# Altium schematic sheet USB.SchDoc
size A4; SheetNumber: 5; SheetTotal: 6
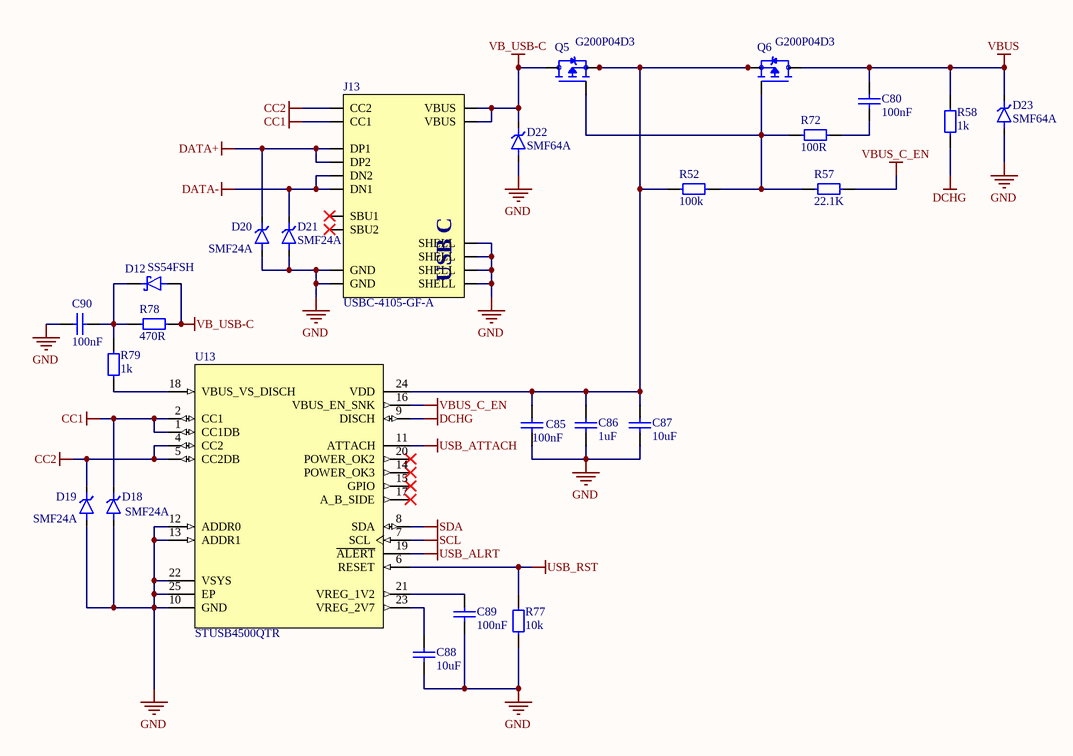
[diagram p0: USB.SchDoc]

## Parts
C80  100nF  [0603 Capacitor]
C85  100nF  [0603 Capacitor]
C86  1uF  [0603 Capacitor]
C87  10uF  [0603 Capacitor]
C88  10uF  [0603 Capacitor]
C89  100nF  [0603 Capacitor]
C90  100nF  [0603 Capacitor]
D12  SS54FSH  [SODFL4725X110N]
D18  SMF24A  [SOD3718X102N]
D19  SMF24A  [SOD3718X102N]
D20  SMF24A  [SOD3718X102N]
D21  SMF24A  [SOD3718X102N]
D22  SMF64A  [SOD3718X102N]
D23  SMF64A  [SOD3718X102N]
J13  USBC-4105-GF-A  [GCT_USB4105-GF-A]
Q5  G200P04D3  [TRANS_AONR21321]
Q6  G200P04D3  [TRANS_AONR21321]
R52  100k  [0603 Resistor]
R57  22.1K  [0603 Resistor]
R58  1k  [0603 Resistor]
R72  100R  [0603 Resistor]
R77  10k  [0603 Resistor]
R78  470R  [0603 Resistor]
R79  1k  [0603 Resistor]
U13  STUSB4500QTR  [QFN50P400X400X90-25N]

## Nets
CC1: D18.C(K1) J13.A5(CC1) U13.1(CC1DB) U13.2(CC1)
CC2: D19.C(K1) J13.B5(CC2) U13.4(CC2) U13.5(CC2DB)
DATA+: D20.C(K1) J13.A6(DP1) J13.B6(DP2)
DATA-: D21.C(K1) J13.A7(DN1) J13.B7(DN2)
DCHG: R58.1(CCW) U13.9(DISCH)
GND: C85.1 C86.1 C87.1 C88.1 C89.1 C90.1 D18.A D19.A D20.A D21.A D22.A D23.A J13.A1_B12(GND) J13.B1_A12(GND) J13.SH1(SHELL) J13.SH2(SHELL) J13.SH3(SHELL) J13.SH4(SHELL) R77.1(CCW) U13.10(GND) U13.12(ADDR0) U13.13(ADDR1) U13.22(VSYS) U13.25(EP)
SCL: U13.7(SCL)
SDA: U13.8(SDA)
USB_ALRT: U13.19(~{ALERT})
USB_ATTACH: U13.11(ATTACH)
USB_RST: R77.2(CW) U13.6(RESET)
VB_USB-C: D12.A D22.C(K1) J13.A4_B9(VBUS) J13.B4_A9(VBUS) Q5.5(D) R78.2(CW)
VBUS: C80.2 D23.C(K1) Q6.5(D) R58.2(CW)
VBUS_C_EN: R57.2(CW) U13.16(VBUS_EN_SNK)
NetC80_1: C80.1 R72.2(CW)
NetC85_2: C85.2 C86.2 C87.2 Q5.1(S) Q5.2(S) Q5.3(S) Q6.1(S) Q6.2(S) Q6.3(S) R52.1(CCW) U13.24(VDD)
NetC88_2: C88.2 U13.23(VREG_2V7)
NetC89_2: C89.2 U13.21(VREG_1V2)
NetC90_2: C90.2 D12.C(K) R78.1(CCW) R79.1(CCW)
NetQ5_4: Q5.4(G) Q6.4(G) R52.2(CW) R57.1(CCW) R72.1(CCW)
NetR79_2: R79.2(CW) U13.18(VBUS_VS_DISCH)

Not connected (* = marked no-connect by the designer): J13 A8(SBU1)* B8(SBU2)*; U13 14(POWER_OK3)* 15(GPIO)* 17(A_B_SIDE)* 20(POWER_OK2)*

## Notes on the sheet
- (in symbol USBC-4105-GF-A) USB C

## Library data of the parts
C80 C85 C89 C90 = Capacitor 100nF 0603: 100nF 50V 0603; MP: KGF15AR71H104KM
C86 = Capacitor 1uF 0603: 1uF 50V 0603
C87 C88 = Capacitor 10uF 0603: 10uF 10V 0603
D12 = SS54FSH: 5A, 40V, Schottky Rectifier; MF: Taiwan Semiconductor; Value: *; SnapEDA_Link: https://www.snapeda.com/parts/SS54FSH/Taiwan+Semiconductor/view-part/?ref=snap; MP: SS54FSH; Check_prices: https://www.snapeda.com/parts/SS54FSH/Taiwan+Semiconductor/view-part/?ref=eda; Availability: In Stock; Price: None; Package: SOD-128-2 Taiwan Semiconductor
D18-D21 = SMF24A: 1-channel  24V ultra-low-capacitance IEC ESD protection diode; MF: Texas Instruments; MP: TPD1E05U06DPYR; SnapEDA_Link: https://www.snapeda.com/parts/TPD1E05U06DPYR/Texas%20Instruments/view-part/383548/?ref=snap; Value: *; Texas_Instruments-Purchase-URL: https://snapeda.com/shop?store=Texas+Instruments&id=383548; Availability: Good; Price: None; Mouser-Purchase-URL: https://snapeda.com/shop?store=Mouser&id=383548; Package: X1SON-2 Texas Instruments; DigiKey-Purchase-URL: https://snapeda.com/shop?store=DigiKey&id=383548
D22 D23 = SMF64A: 1-channel  64V ultra-low-capacitance IEC ESD protection diode; MF: Texas Instruments; MP: TPD1E05U06DPYR; SnapEDA_Link: https://www.snapeda.com/parts/TPD1E05U06DPYR/Texas%20Instruments/view-part/383548/?ref=snap; Value: *; Texas_Instruments-Purchase-URL: https://snapeda.com/shop?store=Texas+Instruments&id=383548; Availability: Good; Price: None; Mouser-Purchase-URL: https://snapeda.com/shop?store=Mouser&id=383548; Package: X1SON-2 Texas Instruments; DigiKey-Purchase-URL: https://snapeda.com/shop?store=DigiKey&id=383548
J13 = USBC-4105-GF-A: MF: {'manufacturer': u'GCT'}; Package: None; Price: None; Value: *; MP: USBC-4105-GF-A; Availability: Unavailable
Q5 Q6 = G200P04D3: P-Channel 40 V 20A Surface; MF: onsemi; MP: BSS138; SnapEDA_Link: https://www.snapeda.com/parts/BSS138/Onsemi/view-part/?ref=snap; Package: SOT-23-3 Motorola; Value: *; Check_prices: https://www.snapeda.com/parts/BSS138/Onsemi/view-part/?ref=eda
R52 = Resistor 100k 0603: 100k 0603; MP: RCG0603100KFKEA
R57 = Resistor 22.1K 0603: 22.1K 0603
R58 R79 = Resistor 1k 0603: 1k 0603
R72 = Resistor 100R 0603: 100R 0603; Manufacturer_Part_Number: RE0603FRE07100RL; MP: RE0603FRE07100RL
R77 = Resistor 10k 0603: 10k 0603; MP: RE0603FRE1310KL
R78 = Resistor 470R 0603: 470R 0603
U13 = STUSB4500QTR: USB Controller USB 2.0 I2C Interface 24-QFN (4x4); MF: STMicroelectronics; SnapEDA_Link: https://www.snapeda.com/parts/STUSB4500QTR/STMicroelectronics/view-part/?ref=snap; Package: VFQFN-24 STMicroelectronics; Value: *; MP: STUSB4500QTR; Check_prices: https://www.snapeda.com/parts/STUSB4500QTR/STMicroelectronics/view-part/?ref=eda